# Altium project PowerManagementBoard_V3.PrjPcb
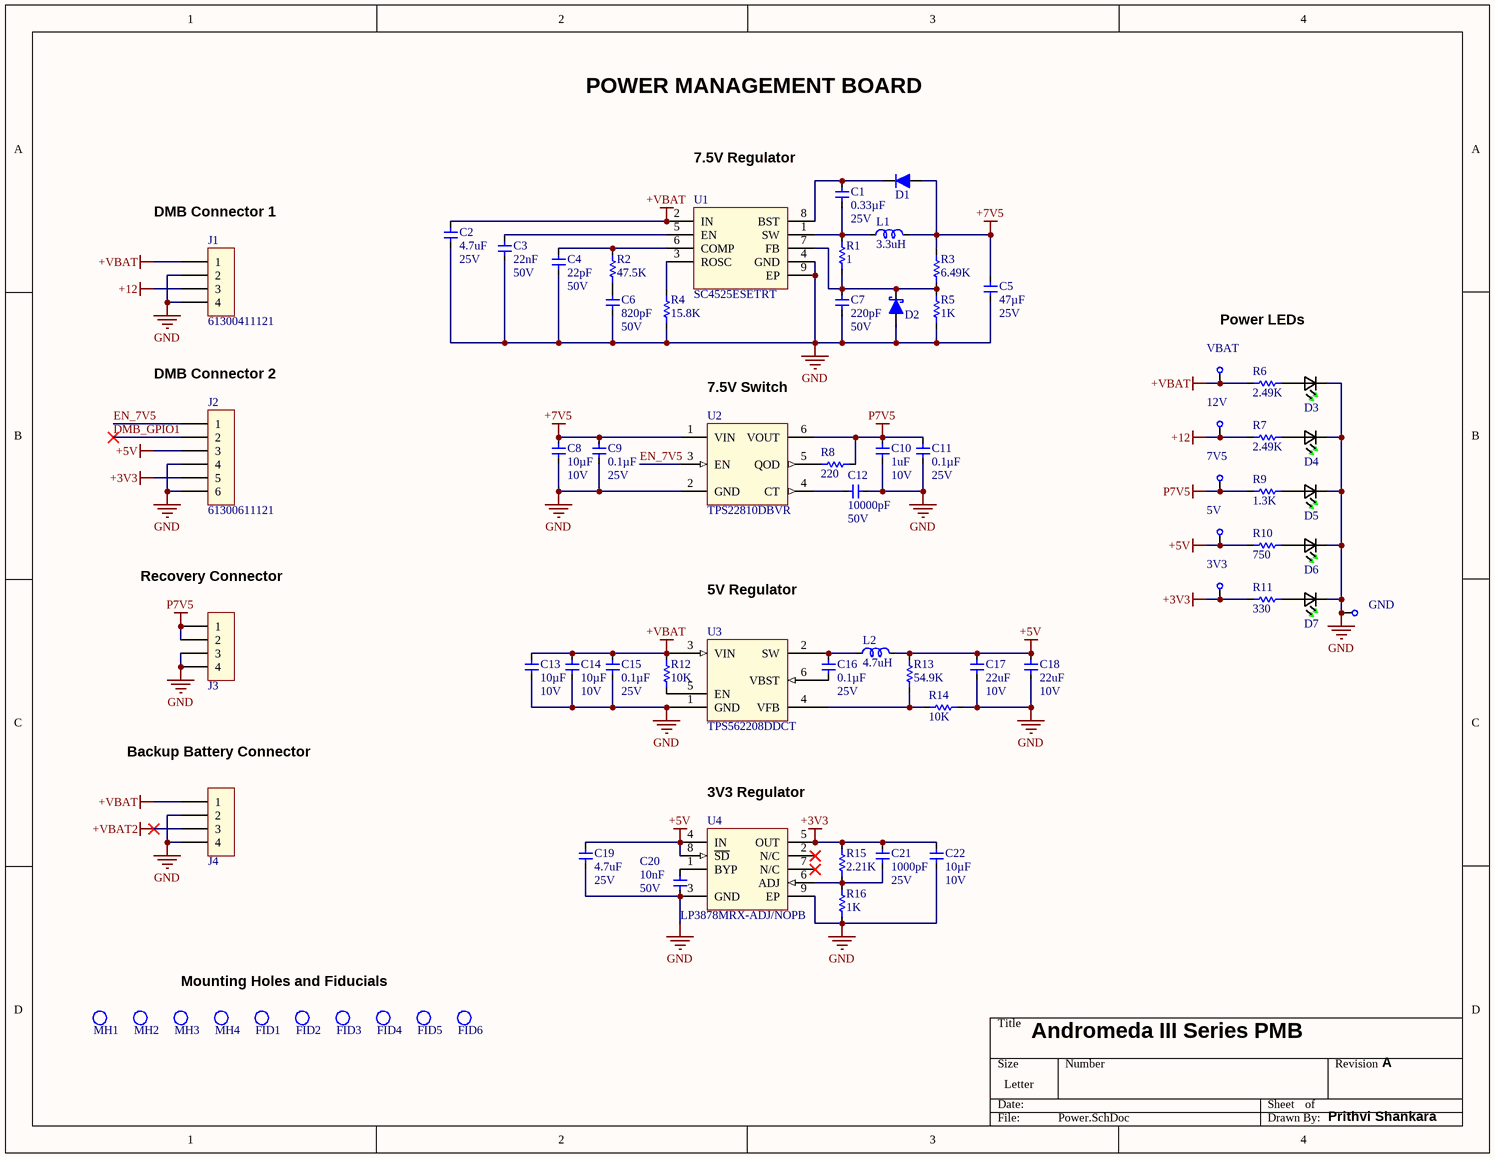
[diagram p0: Power.SchDoc]
1 sheet, 71 parts. Net scope: global (net labels, ports and power ports of the same name join across sheets).
Board file: PMBV3.PcbDoc

## Sheet Power.SchDoc
size Letter; DrawnBy: Prithvi Shankara; DocumentNumber: 1; SheetNumber: 1; SheetTotal: 1

### Parts
3V3  Testpoint  [Testpoint]  (value not drawn)  (no BOM)
5V  Testpoint  [Testpoint]  (value not drawn)  (no BOM)
7V5  Testpoint  [Testpoint]  (value not drawn)  (no BOM)
12V  Testpoint  [Testpoint]  (value not drawn)  (no BOM)
C1  Capacitance: 0.33µF  Voltage - Rated: 25V  [0603[1608]]  (hidden comment: CGA3E3X7R1E334K080AB)
C2  Capacitance: 4.7uF  Voltage - Rated: 25V  [0603[1608]]  (hidden comment: CL10A475KA8NQNC)
C3  Capacitance: 22nF  Voltage - Rated: 50V  [0603[1608]]  (hidden comment: CC0603KRX7R9BB223)
C4  Capacitance: 22pF  Voltage - Rated: 50V  [0603[1608]]  (hidden comment: CC0603JRNPO9BN220)
C5  Capacitance: 47µF  Voltage - Rated: 25V  [1206[3216]]  (hidden comment: C3216X5R1E476M160AC)
C6  Capacitance: 820pF  Voltage - Rated: 50V  [0603[1608]]  (hidden comment: CC0603KRX7R9BB821)
C7  Capacitance: 220pF  Voltage - Rated: 50V  [0603[1608]]  (hidden comment: CC0603KRX7R9BB221)
C8  Capacitance: 10µF  Voltage - Rated: 10V  [0603[1608]]  (hidden comment: CL10A106MP8NNNC)
C9  Capacitance: 0.1µF  Voltage - Rated: 25V  [0603[1608]]  (hidden comment: CGA3E2X7R1E104K080AA)
C10  Capacitance: 1uF  Voltage - Rated: 10V  [0603[1608]]  (hidden comment: CL10A105KP8NNNC)
C11  Capacitance: 0.1µF  Voltage - Rated: 25V  [0603[1608]]  (hidden comment: CGA3E2X7R1E104K080AA)
C12  Capacitance: 10000pF  Voltage - Rated: 50V  [0603[1608]]  (hidden comment: CGA3E2X7R1H103K080AA)
C13  Capacitance: 10µF  Voltage - Rated: 10V  [0603[1608]]  (hidden comment: CL10A106MP8NNNC)
C14  Capacitance: 10µF  Voltage - Rated: 10V  [0603[1608]]  (hidden comment: CL10A106MP8NNNC)
C15  Capacitance: 0.1µF  Voltage - Rated: 25V  [0603[1608]]  (hidden comment: CGA3E2X7R1E104K080AA)
C16  Capacitance: 0.1µF  Voltage - Rated: 25V  [0603[1608]]  (hidden comment: CGA3E2X7R1E104K080AA)
C17  Capacitance: 22uF  Voltage - Rated: 10V  [0603[1608]]  (hidden comment: C1608X5R1A226M080AC)
C18  Capacitance: 22uF  Voltage - Rated: 10V  [0603[1608]]  (hidden comment: C1608X5R1A226M080AC)
C19  Capacitance: 4.7uF  Voltage - Rated: 25V  [0603[1608]]  (hidden comment: CL10A475KA8NQNC)
C20  Capacitance: 10nF  Voltage - Rated: 50V  [0603[1608]]  (hidden comment: GRM1885C1H103JA01D)
C21  Capacitance: 1000pF  Voltage - Rated: 25V  [0603[1608]]  (hidden comment: C0603C102K3GACTU)
C22  Capacitance: 10µF  Voltage - Rated: 10V  [0603[1608]]  (hidden comment: CL10A106MP8NNNC)
D1  1N4148W-7-F  [1N4148W-7-F]  (value not drawn)
D2  B330A-13-F  [B330A-13-F]  (value not drawn)
D3  LTST-C191KGKT  [LTST-C191KGKT]  (value not drawn)
D4  LTST-C191KGKT  [LTST-C191KGKT]  (value not drawn)
D5  LTST-C191KGKT  [LTST-C191KGKT]  (value not drawn)
D6  LTST-C191KGKT  [LTST-C191KGKT]  (value not drawn)
D7  LTST-C191KGKT  [LTST-C191KGKT]  (value not drawn)
FID1  FID_1MM_ROUND_SL  [FID_1MM_ROUND_SL]  (value not drawn)  (no BOM)
FID2  FID_1MM_ROUND_SL  [FID_1MM_ROUND_SL]  (value not drawn)  (no BOM)
FID3  FID_1MM_ROUND_SL  [FID_1MM_ROUND_SL]  (value not drawn)  (no BOM)
FID4  FID_1MM_ROUND_SL  [FID_1MM_ROUND_SL]  (value not drawn)  (no BOM)
FID5  FID_1MM_ROUND_SL  [FID_1MM_ROUND_SL]  (value not drawn)  (no BOM)
FID6  FID_1MM_ROUND_SL  [FID_1MM_ROUND_SL]  (value not drawn)  (no BOM)
GND  Testpoint  [Testpoint]  (value not drawn)  (no BOM)
J1  61300411121  [61300411121]
J2  61300611121  [61300611121]
J3  0430450400  [0430450400]  (value not drawn)
J4  0430450400  [0430450400]  (value not drawn)
L1  value 3.3uH  [744777003]  (hidden comment: 744777003)
L2  value 4.7uH  [DFE252012P-4R7M=P2]  (hidden comment: DFE252012P-4R7M=P2)
MH1  9774110360R  [Standoff]  (value not drawn)
MH2  9774110360R  [Standoff]  (value not drawn)
MH3  Mounting Hole  [MOUNT-HOLE]  (value not drawn)  (no BOM)
MH4  Mounting Hole  [MOUNT-HOLE]  (value not drawn)  (no BOM)
R1  Resistance: 1  [0603[1608]]  (hidden comment: RC0603FR-071RL)
R2  Resistance: 47.5K  [0603[1608]]  (hidden comment: ERA-3AEB4752V)
R3  Resistance: 6.49K  [0603[1608]]  (hidden comment: RT0603DRE076K49L)
R4  Resistance: 15.8K  [0603[1608]]  (hidden comment: ERA-3AEB1582V)
R5  Resistance: 1K  [0603[1608]]  (hidden comment: RC0603FR-071KL)
R6  Resistance: 2.49K  [0603[1608]]  (hidden comment: ERA-3AEB2491V)
R7  Resistance: 2.49K  [0603[1608]]  (hidden comment: ERA-3AEB2491V)
R8  Resistance: 220  [0603[1608]]  (hidden comment: CRGCQ0603F220R)
R9  Resistance: 1.3K  [0603[1608]]  (hidden comment: MCT06030C1301FP500)
R10  Resistance: 750  [0603[1608]]  (hidden comment: ESR03EZPJ751)
R11  Resistance: 330  [0603[1608]]  (hidden comment: RC1608F331CS)
R12  Resistance: 10K  [0603[1608]]  (hidden comment: ERJ-3GEYJ103V)
R13  Resistance: 54.9K  [0603[1608]]  (hidden comment: RC0603FR-0754K9L)
R14  Resistance: 10K  [0603[1608]]  (hidden comment: ERJ-3GEYJ103V)
R15  Resistance: 2.21K  [0603[1608]]  (hidden comment: ERJ-3EKF2211V)
R16  Resistance: 1K  [0603[1608]]  (hidden comment: RC0603FR-071KL)
U1  SC4525ESETRT  [SOIC127P600X175_HS-9N]
U2  TPS22810DBVR  [SOT95P280X145-6N]
U3  TPS562208DDCT  [TPS562208DDCT]
U4  LP3878MRX-ADJ/NOPB  [SOIC127P600X170_HS-9N]
VBAT  Testpoint  [Testpoint]  (value not drawn)  (no BOM)

### Nets
+3V3: 3V3.1 C21.2 C22.2 J2.5 R11.1 R15.2 U4.5(OUT)
+5V: 5V.1 C17.2 C18.2 C19.2 J2.3 L2.2 R10.1 R13.1 U4.4(IN) U4.8(~{SD})
+7V5: C5.2 C8.2 C9.2 D1.1(A) L1.2 R3.2 U2.1(VIN)
+12: 12V.1 J1.3 R7.1
+VBAT: C2.2 C13.2 C14.2 C15.2 J1.1 J4.1 R6.1 R12.2 U1.2(IN) U3.3(VIN) VBAT.1
+VBAT2: J4.3
GND: C2.1 C3.1 C4.1 C5.1 C6.1 C7.1 C8.1 C9.1 C10.1 C11.1 C12.2 C13.1 C14.1 C15.1 C17.1 C18.1 C19.1 C20.1 C22.1 D2.1 D3.1(K2) D4.1(K2) D5.1(K2) D6.1(K2) D7.1(K2) GND.1 J1.2 J1.4 J2.4 J2.6 J3.3 J3.4 J4.2 J4.4 R4.1 R5.1 R14.1 R16.1 U1.4(GND) U1.9(EP) U2.2(GND) U3.1(GND) U4.3(GND) U4.9(EP)
P7V5: 7V5.1 C10.2 C11.2 J3.1 J3.2 R8.2 R9.1 U2.6(VOUT)
DMB_GPIO1: J2.2
EN_7V5: J2.1 U2.3(EN)
NetC1_1: C1.1 L1.1 R1.2 U1.1(SW)
NetC1_2: C1.2 D1.2(C) U1.8(BST)
NetC3_2: C3.2 U1.5(EN)
NetC4_2: C4.2 R2.2 U1.6(COMP)
NetC6_2: C6.2 R2.1
NetC7_2: C7.2 D2.2 R1.1 R3.1 R5.2 U1.7(FB)
NetC12_1: C12.1 U2.4(CT)
NetC16_1: C16.1 U3.6(VBST)
NetC16_2: C16.2 L2.1 U3.2(SW)
NetC20_2: C20.2 U4.1(BYP)
NetC21_1: C21.1 R15.1 R16.2 U4.6(ADJ)
NetD3_2: D3.2(A2) R6.2
NetD4_2: D4.2(A2) R7.2
NetD5_2: D5.2(A2) R9.2
NetD6_2: D6.2(A2) R10.2
NetD7_2: D7.2(A2) R11.2
NetR4_2: R4.2 U1.3(ROSC)
NetR8_1: R8.1 U2.5(QOD)
NetR12_1: R12.1 U3.5(EN)
NetR13_2: R13.2 R14.2 U3.4(VFB)

Not connected (* = marked no-connect by the designer): U4 2(N/C)* 7(N/C)*

### Notes on the sheet
- POWER MANAGEMENT BOARD
- 7.5V Regulator
- (near J1) DMB Connector 1
- Power LEDs
- DMB Connector 2
- (near U2) 7.5V Switch
- (near J3) Recovery Connector
- 5V Regulator
- (near J4) Backup Battery Connector
- 3V3 Regulator
- Mounting Holes and Fiducials
- Andromeda III Series PMB
- A
- Prithvi Shankara

### Library data of the parts
3V3 5V 7V5 12V GND VBAT = Testpoint: TESTPOINT 0.7MMD Hole, 1.2MMW, 1.2MML
C1 = CGA3E3X7R1E334K080AB: CAP CER 0.33UF 25V X7R 0603; Manufacturer: TDK Corporation; Tolerance: ±10%; Temperature Coefficient: X7R; Operating Temperature: -55°C ~ 125°C; Mounting Type: Surface Mount, MLCC; Package / Case: 0603 (1608 Metric); Size / Dimension: 0.063" L x 0.031" W (1.60mm x 0.80mm); Manufacturer Part Number: CGA3E3X7R1E334K080AB; Thickness (Max): 0.034" (0.87mm); ComponentLink1Description: Datasheet; ComponentLink1URL: https://content.kemet.com/datasheets/KEM_C1003_C0G_SMD.pdf; Supplier 1: Digi-Key; Supplier Part Number 1: 445-12544-1-ND
C2 C19 = CL10A475KA8NQNC: CAP CER 4.7UF 25V X5R 0603; Manufacturer: Samsung Electro-Mechanics; Tolerance: ±10%; Temperature Coefficient: X5R; Operating Temperature: -55°C ~ 85°C; Mounting Type: Surface Mount, MLCC; Package / Case: 0603 (1608 Metric); Size / Dimension: 0.063" L x 0.031" W (1.60mm x 0.80mm); Manufacturer Part Number: CL10A475KA8NQNC; Thickness (Max): 0.035" (0.90mm); ComponentLink1Description: Datasheet; ComponentLink1URL: http://www.samsungsem.com/kr/support/product-search/mlcc/__icsFiles/afieldfile/2019/05/10/19-CL10A475KA8NQNC.pdf; Supplier 1: Digi-Key; Supplier Part Number 1: 1276-1900-1-ND
C3 = CC0603KRX7R9BB223: CAP CER 0.022UF 50V X7R 0603; Manufacturer: Yageo; Tolerance: ±10%; Temperature Coefficient: X7R; Operating Temperature: -55°C ~ 125°C; Mounting Type: Surface Mount, MLCC; Package / Case: 0603 (1608 Metric); Size / Dimension: 0.063" L x 0.031" W (1.60mm x 0.80mm); Manufacturer Part Number: CC0603KRX7R9BB223; Thickness (Max): 0.035" (0.90mm); ComponentLink1Description: Datasheet; ComponentLink1URL: https://www.yageo.com/upload/media/product/productsearch/datasheet/mlcc/UPY-GP_NP0_16V-to-50V_18.pdf; Supplier 1: Digi-Key; Supplier Part Number 1: 311-1370-1-ND
C4 = CC0603JRNPO9BN220: CAP CER 22PF 50V C0G/NPO 0603; Manufacturer: Yageo; Tolerance: ±5%; Temperature Coefficient: C0G, NP0; Operating Temperature: -55°C ~ 125°C; Mounting Type: Surface Mount, MLCC; Package / Case: 0603 (1608 Metric); Size / Dimension: 0.063" L x 0.031" W (1.60mm x 0.80mm); Manufacturer Part Number: CC0603JRNPO9BN220; Thickness (Max): 0.035" (0.90mm); ComponentLink1Description: Datasheet; ComponentLink1URL: https://www.yageo.com/upload/media/product/productsearch/datasheet/mlcc/UPY-GP_NP0_16V-to-50V_18.pdf; Supplier 1: Digi-Key; Supplier Part Number 1: 311-1062-1-ND
C5 = C3216X5R1E476M160AC: CAP CER 47UF 25V X5R 1206; Manufacturer: TDK Corporation; Tolerance: ±20%; Temperature Coefficient: X5R; Operating Temperature: -55°C ~ 85°C; Mounting Type: Surface Mount, MLCC; Package / Case: 1206 (3216 Metric); Size / Dimension: 0.126" L x 0.063" W (3.20mm x 1.60mm); Manufacturer Part Number: C3216X5R1E476M160AC; Thickness (Max): 0.071" (1.80mm); ComponentLink1Description: Datasheet; ComponentLink1URL: http://www.samsungsem.com/kr/support/product-search/mlcc/__icsFiles/afieldfile/2019/05/10/19-CL10A105KP8NNNC.pdf; Supplier 1: Digi-Key; Supplier Part Number 1: 445-8047-1-ND
C6 = CC0603KRX7R9BB821: CAP CER 820PF 50V X7R 0603; Manufacturer: Yageo; Tolerance: ±10%; Temperature Coefficient: X7R; Operating Temperature: -55°C ~ 125°C; Mounting Type: Surface Mount, MLCC; Package / Case: 0603 (1608 Metric); Size / Dimension: 0.063" L x 0.031" W (1.60mm x 0.80mm); Manufacturer Part Number: CC0603KRX7R9BB821; Thickness (Max): 0.035" (0.90mm); ComponentLink1Description: Datasheet; ComponentLink1URL: https://www.yageo.com/upload/media/product/productsearch/datasheet/mlcc/UPY-GP_NP0_16V-to-50V_18.pdf; Supplier 1: Digi-Key; Supplier Part Number 1: 311-1189-1-ND
C7 = CC0603KRX7R9BB221: CAP CER 220PF 50V X7R 0603; Manufacturer: Yageo; Tolerance: ±10%; Temperature Coefficient: X7R; Operating Temperature: -55°C ~ 125°C; Mounting Type: Surface Mount, MLCC; Package / Case: 0603 (1608 Metric); Size / Dimension: 0.063" L x 0.031" W (1.60mm x 0.80mm); Manufacturer Part Number: CC0603KRX7R9BB221; Thickness (Max): 0.035" (0.90mm); ComponentLink1Description: Datasheet; ComponentLink1URL: https://www.yageo.com/upload/media/product/productsearch/datasheet/mlcc/UPY-GP_NP0_16V-to-50V_18.pdf; Supplier 1: Digi-Key; Supplier Part Number 1: 311-1077-1-ND
C8 C13 C14 C22 = CL10A106MP8NNNC: CAP CER 10UF 10V X5R 0603; Manufacturer: Samsung Electro-Mechanics; Tolerance: ±20%; Temperature Coefficient: X5R; Operating Temperature: -55°C ~ 85°C; Mounting Type: Surface Mount, MLCC; Package / Case: 0603 (1608 Metric); Size / Dimension: 0.063" L x 0.031" W (1.60mm x 0.80mm); Manufacturer Part Number: CL10A106MP8NNNC; Thickness (Max): 0.035" (0.90mm); ComponentLink1Description: Datasheet; ComponentLink1URL: https://static6.arrow.com/aropdfconversion/f91a1722e2705c3d73cfb1979021b64ae4055093/19-cl10a106mp8nnnc.pdf; Supplier 1: Digi-Key; Supplier Part Number 1: 1276-1871-1-ND
C9 C11 C15 C16 = CGA3E2X7R1E104K080AA: CAP CER 0.1UF 25V X7R 0603; Manufacturer: TDK Corporation; Tolerance: ±10%; Temperature Coefficient: X7R; Operating Temperature: -55°C ~ 125°C; Mounting Type: Surface Mount, MLCC; Package / Case: 0603 (1608 Metric); Size / Dimension: 0.063" L x 0.031" W (1.60mm x 0.80mm); Manufacturer Part Number: CGA3E2X7R1E104K080AA; Thickness (Max): 0.035" (0.90mm); ComponentLink1Description: Datasheet; ComponentLink1URL: https://product.tdk.com/info/en/catalog/spec/mlccspec_automotive_general_en.pdf; Supplier 1: Digi-Key; Supplier Part Number 1: 445-5667-1-ND
C10 = CL10A105KP8NNNC: CAP CER 1UF 10V X5R 0603; Manufacturer: Samsung Electro-Mechanics; Tolerance: ±10%; Temperature Coefficient: X5R; Operating Temperature: -55°C ~ 85°C; Mounting Type: Surface Mount, MLCC; Package / Case: 0603 (1608 Metric); Size / Dimension: 0.063" L x 0.031" W (1.60mm x 0.80mm); Manufacturer Part Number: CL10A105KP8NNNC; Thickness (Max): 0.035" (0.90mm); ComponentLink1Description: Datasheet; ComponentLink1URL: http://www.samsungsem.com/kr/support/product-search/mlcc/__icsFiles/afieldfile/2019/05/10/19-CL10A105KP8NNNC.pdf; Supplier 1: Digi-Key; Supplier Part Number 1: 1276-1182-1-ND
C12 = CGA3E2X7R1H103K080AA: CAP CER 10000PF 50V X7R 0603; Manufacturer: TDK Corporation; Tolerance: ±10%; Temperature Coefficient: X7R; Operating Temperature: -55°C ~ 125°C; Mounting Type: Surface Mount, MLCC; Package / Case: 0603 (1608 Metric); Size / Dimension: 0.063" L x 0.031" W (1.60mm x 0.80mm); Manufacturer Part Number: CGA3E2X7R1H103K080AA; Thickness (Max): 0.035" (0.90mm); ComponentLink1Description: Datasheet; ComponentLink1URL: https://product.tdk.com/info/en/catalog/spec/mlccspec_automotive_general_en.pdf; Supplier 1: Digi-Key; Supplier Part Number 1: 445-5662-1-ND
C17 C18 = C1608X5R1A226M080AC: CAP CER 22UF 10V X5R 0603; Manufacturer: TDK Corporation; Tolerance: ±20%; Temperature Coefficient: X5R; Operating Temperature: -55°C ~ 85°C; Mounting Type: Surface Mount, MLCC; Package / Case: 0603 (1608 Metric); Size / Dimension: 0.063" L x 0.031" W (1.60mm x 0.80mm); Manufacturer Part Number: C1608X5R1A226M080AC; Thickness (Max): 0.039" (1.00mm); ComponentLink1Description: Datasheet; ComponentLink1URL: http://datasheets.avx.com/C0GNP0-Dielectric.pdf; Supplier 1: Digi-Key; Supplier Part Number 1: 445-9077-1-ND
C20 = GRM1885C1H103JA01D: CAP CER 10000PF 50V C0G/NP0 0603; Manufacturer: Murata Electronics; Tolerance: ±50%; Temperature Coefficient: C0G, NP0; Operating Temperature: -55°C ~ 125°C; Mounting Type: Surface Mount, MLCC; Package / Case: 0603 (1608 Metric); Size / Dimension: 0.063" L x 0.031" W (1.60mm x 0.80mm); Manufacturer Part Number: GRM1885C1H103JA01D; Thickness (Max): 0.035" (0.90mm); ComponentLink1Description: Datasheet; ComponentLink1URL: https://www.murata.com/~/media/webrenewal/support/library/catalog/products/capacitor/mlcc/c02e.ashx?la=en-us; Supplier 1: Digi-Key; Supplier Part Number 1: 490-9666-1-ND
C21 = C0603C102K3GACTU: CAP CER 1000PF 25V C0G/NP0 0603; Manufacturer: KEMET; Tolerance: ±10%; Temperature Coefficient: C0G, NP0; Operating Temperature: -55°C ~ 85°C; Mounting Type: Surface Mount, MLCC; Package / Case: 0603 (1608 Metric); Size / Dimension: 0.063" L x 0.031" W (1.60mm x 0.80mm); Manufacturer Part Number: C0603C102K3GACTU; Thickness (Max): 0.034" (0.87mm); ComponentLink1Description: Datasheet; ComponentLink1URL: https://content.kemet.com/datasheets/KEM_C1003_C0G_SMD.pdf; Supplier 1: Digi-Key; Supplier Part Number 1: 399-7833-1-ND
D1 = 1N4148W-7-F: DIODE GEN PURP 100V 300MA SOD123; Manufacturer: Diodes Incorporated; Diode Type: Standard; Current - Average Rectified (Io): 300mA (DC); Voltage - Forward (Vf) (Max) @ If: 1.25V @ 150mA; Speed: Small Signal =< 200mA (Io), Any Speed; Reverse Recovery Time (trr): 4ns; Current - Reverse Leakage @ Vr: 1µA @ 75V; Capacitance @ Vr, F: 2pF @ 0V, 1MHz; ComponentLink1Description: Datasheet; ComponentLink1URL: https://www.diodes.com/assets/Datasheets/ds30086.pdf; Manufacturer Part Number: 1N4148W-7-F; Voltage - DC Reverse (Vr) (Max): 100V; Mounting Type: Surface Mount; Package / Case: SOD-123; Operating Temperature - Junction: -65°C ~ 150°C; Supplier 1: Digi-Key; Supplier Part Number 1: 1N4148W-FDICT-ND
D2 = B330A-13-F: DIODE SCHOTTKY 30V 3A SMA; Manufacturer: Diodes Incorporated; Voltage - Forward (Vf) (Max) @ If: 500mV @ 3A; 500mV @ 3A: Fast Recovery =< 500ns, > 200mA (Io); Current - Reverse Leakage @ Vr: 500µA @ 30V; Capacitance @ Vr, F: 200pF @ 4V, 1MHz; ComponentLink1Description: Datasheet; ComponentLink1URL: https://www.diodes.com/assets/Datasheets/ds30891.pdf; Manufacturer Part Number: B330A-13-F; Type: Schottky; Supplier 1: Digi-Key; Supplier Part Number 1: B330A-FDICT-ND; Voltage - DC Reverse (Vr) (Max): 30V; Current - Average Rectified (Io): 3A; Mounting Type: Surface Mount; Package / Case: DO-214AC, SMA; Operating Temperature - Junction: -55°C ~ 150°C
D3-D7 = LTST-C191KGKT: LED GREEN CLEAR SMD 0603; Manufacturer: Lite-On Inc.; Lens Color: Colourless; Millicandela Rating: 35mcd; Lens Style: Rectangle with Flat Top; Lens Size: 1.10mm x 0.80mm; Voltage - Forward (Vf) (Typ): 2V; Current - Test: 20mA; Viewing Angle: 130°; Wavelength - Dominant: 571nm; Wavelength - Peak: 574nm; ComponentLink1Description: Datasheet; ComponentLink1URL: http://optoelectronics.liteon.com/upload/download/DS22-2000-228/LTST-C191KGKT.PDF; Manufacturer Part Number: LTST-C191KGKT; Colour: Green; Lens Transparency: Clear; Mounting Type: Surface Mount; Package / Case: 0603 (1608 Metric); Size / Dimension: 1.60mm L x 0.80mm W; Height (Max): 0.65mm; Supplier 1: Digi-Key; Supplier Part Number 1: 160-1446-1-ND
FID1-FID6 = FID_1MM_ROUND_SL: Fiducial 1mm Round Single Layer
J1 = 61300411121: CONN HEADER VERT 4POS MALE 2.54MM; Manufacturer: Würth Elektronik; Pitch - Mating: 0.100" (2.54mm); Number of Positions: 4; Style: Board to Board or Cable; Shrouding: Unshrouded; Contact Length - Mating: 0.236" (6.00mm); Contact Length - Post: 0.118" (3.00mm); Overall Contact Length: 0.454" (11.54mm); Material Flammability Rating: UL94 V-0; Current Rating (Amps): 3A; Voltage Rating: 250V; ComponentLink1Description: Drawing; ComponentLink1URL: https://www.we-online.de/katalog/datasheet/6130xx11121.pdf; Manufacturer Part Number: 61300411121; Connector Type: Header; Contact Type: Male Pin; Number of Rows: 1; Mounting Type: Through Hole; Termination: Solder; Fastening Type: Push-Pull; Insulation Height: 0.100" (2.54mm); Contact Shape: Square; Contact Finish - Mating: Gold; Contact Material: Copper Alloy; Insulation Material: Polybutylene Terephthalate (PBT); Operating Temperature: -40°C ~ 105°C; Insulation Color: Black; Supplier 1: Digi-Key; Supplier Part Number 1: 732-5317-ND
J2 = 61300611121: CONN HEADER VERT 6POS MALE 2.54MM; Manufacturer: Würth Elektronik; Pitch - Mating: 0.100" (2.54mm); Number of Positions: 6; Style: Board to Board or Cable; Shrouding: Unshrouded; Contact Length - Mating: 0.236" (6.00mm); Contact Length - Post: 0.118" (3.00mm); Overall Contact Length: 0.454" (11.54mm); Material Flammability Rating: UL94 V-0; Current Rating (Amps): 3A; Voltage Rating: 250V; ComponentLink1Description: Drawing; ComponentLink1URL: https://www.we-online.de/katalog/datasheet/6130xx11121.pdf; Manufacturer Part Number: 61300611121; Connector Type: Header; Contact Type: Male Pin; Number of Rows: 1; Mounting Type: Through Hole; Termination: Solder; Fastening Type: Push-Pull; Insulation Height: 0.100" (2.54mm); Contact Shape: Square; Contact Finish - Mating: Gold; Contact Material: Copper Alloy; Insulation Material: Polybutylene Terephthalate (PBT); Operating Temperature: -40°C ~ 105°C; Insulation Color: Black; Supplier 1: Digi-Key; Supplier Part Number 1: 732-5319-ND
J3 J4 = 0430450400: CONN HEADER R/A 4POS 3MM; Manufacturer: Molex; Number of Positions: 4; Row Spacing - Mating: 0.118" (3.00mm); Shrouding: Shrouded - 4 Wall; Contact Length - Post: 0.125" (3.18mm); Material Flammability Rating: UL94 V-0; Current Rating (Amps): 8A; Voltage Rating: 600V; ComponentLink1Description: Datasheet; ComponentLink1URL: https://www.molex.com/pdm_docs/sd/430450400_sd.pdf; ComponentLink2Description: Product Specification; ComponentLink2URL: https://www.molex.com/pdm_docs/ps/PS-43045.pdf; Manufacturer Part Number: 0430450400; Contact Type: 0.118" (3.00mm); Number of Rows: 2; Mounting Type: Through Hole, Right Angle; Termination: Solder; Fastening Type: Locking Ramp; Insulation Height: 0.290" (7.37mm); Contact Shape: Square; Contact Finish - Mating: Tin; Contact Finish Thickness - Mating: 100.0µin (2.54µm); Contact Finish - Post: Tin; Contact Material: Brass; Insulation Material: Liquid Crystal Polymer (LCP), Glass Filled; Features: Board Lock; Insulation Color: Black; Supplier 1: Digi-Key; Supplier Part Number 1: WM1814-ND
L1 = 744777003: SMT SHIELDED POWER INDUCTOR SIZE; Manufacturer: Würth Elektronik; Type: Wirewound; Material - Core: Ferrite; Tolerance: +-20%; Current Rating (Amps): 3.5A; DC Resistance (DCR): 30mOhm Max; Inductance Frequency - Test: 55MHz; Current - Saturation: 4.6A; Series: 744777003; Shielding: Shielded; Operating Temperature: -40°C ~ 125°C; Mounting Type: Surface Mount; Size/Dimension: 0.287"" L x 0.287"" W (7.30mm x 7.30mm); Height - Seated (Max): 0.177"" (4.50mm); ComponentLink1Description: Datasheet; ComponentLink1URL: https://www.we-online.com/catalog/datasheet/744777003.pdf; Supplier Device Package: 7345; Supplier 1: Digi-Key; Supplier Part Number 1: 732-13497-1-ND; Ratings: AEC-Q200
L2 = DFE252012P-4R7M=P2: FIXED IND 4.7UH 2A 200 MOHM SMD; Manufacturer: Murata Electronics; Type: Wirewound; Material - Core: Iron Powder; Tolerance: +-20%; Shielding: Shielded; DC Resistance (DCR): 200mOhm Max; Inductance Frequency - Test: 1MHz; Supplier 1: Digi-Key; Series: DFE252012P; Current Rating (Amps): 2A; Operating Temperature: -40C to 125C; Mounting Type: Surface Mount; Size/Dimension: 0.098" L x 0.079" W (2.50mm x 2.00mm); Height - Seated (Max): 0.047" (1.20mm); Supplier Part Number 1: 490-10651-1-ND; Manufacturer Part Number: DFE252012P-4R7M=P2
MH1 MH2 = 9774110360R: ROUND STANDOFF M3X0.5 STEEL 11MM; Manufacturer: Würth Elektronik; Threaded/Unthreaded: Threaded; Gender: Female; Between Board Height: 0.433" (11.00mm); ComponentLink1Description: Datasheet; ComponentLink1URL: https://www.keyelco.com/userAssets/file/M65p77.pdf; Manufacturer Part Number: 9774110360R; Type: Round Standoff; Screw, Thread Size: M3x0.5; Diameter - Outside: 0.236" (5.99mm); Length - Overall: 0.488" (12.40mm); Material: Steel; Features: Surface Mount; Supplier 1: Digi-Key; Supplier Part Number 1: 732-5278-1-ND
MH3 MH4 = Mounting Hole: #4 Screw, 0.116in Diameter
R1 = RC0603FR-071RL: RES SMD 1 OHM 1% 1/10W 0603; Manufacturer: Yageo; Power  (W): 0.1W; Temperature Coefficient: ±200ppm/°C; Package: 0603 (1608 Metric); Tolerance: ±1%; Operating Temperature: -55°C ~ 155°C; Composition: Thick Film; Manufacturer Part Number: RC0603FR-071RL; ComponentLink1Description: Datasheet; ComponentLink1URL: https://www.yageo.com/upload/media/product/productsearch/datasheet/rchip/PYu-RC_Group_51_RoHS_L_10.pdf; Supplier 1: Digi-Key; Supplier Part Number 1: 311-1.00HRCT-ND
R2 = ERA-3AEB4752V: RES SMD 47.5KOHM 0.1% 1/10W 0603; Manufacturer: Panasonic Electronic Components; Power  (W): 0.1W; Temperature Coefficient: ±25ppm/°C; Package: 0603 (1608 Metric); Tolerance: ±0.1%; Operating Temperature: -55°C ~ 155°C; Composition: Thin Film; Manufacturer Part Number: ERA-3AEB4752V; ComponentLink1Description: Datasheet; ComponentLink1URL: https://industrial.panasonic.com/cdbs/www-data/pdf/RDM0000/AOA0000C307.pdf; Supplier 1: Digi-Key; Supplier Part Number 1: P47.5KDBCT-ND
R3 = RT0603DRE076K49L: RES SMD 6.49KOHM 0.5% 1/10W 0603; Manufacturer: Yageo; Power  (W): 0.1W; Temperature Coefficient: ±500ppm/°C; Package: 0603 (1608 Metric); Tolerance: ±0.5%; Operating Temperature: -55°C ~ 155°C; Composition: Thick Film; Manufacturer Part Number: RT0603DRE076K49L; ComponentLink1Description: Datasheet; ComponentLink1URL: https://4donline.ihs.com/images/VipMasterIC/IC/YAGO/YAGO-S-A0008510989/YAGO-S-A0008510989-1.pdf?hkey=52A5661711E402568146F3353EA87419; Supplier 1: Digi-Key; Supplier Part Number 1: 311-2658-1-ND
R4 = ERA-3AEB1582V: RES SMD 15.8KOHM 0.1% 1/10W 0603; Manufacturer: Panasonic Electronic Components; Power  (W): 0.1W; Temperature Coefficient: ±25ppm/°C; Package: 0603 (1608 Metric); Tolerance: ±0.1%; Operating Temperature: -55°C ~ 155°C; Composition: Thin Film; Manufacturer Part Number: ERA-3AEB1582V; ComponentLink1Description: Datasheet; ComponentLink1URL: https://industrial.panasonic.com/cdbs/www-data/pdf/RDM0000/AOA0000C307.pdf; Supplier 1: Digi-Key; Supplier Part Number 1: P15.8KDBCT-ND
R5 R16 = RC0603FR-071KL: RES SMD 1K OHM 1% 1/10W 0603; Manufacturer: Yageo; Power  (W): 0.1W; Temperature Coefficient: ±100ppm/°C; Package: 0603 (1608 Metric); Tolerance: ±1%; Operating Temperature: -55°C ~ 155°C; Composition: Thick Film; Manufacturer Part Number: RC0603FR-071KL; ComponentLink1Description: Datasheet; ComponentLink1URL: https://www.yageo.com/upload/media/product/productsearch/datasheet/rchip/PYu-RC_Group_51_RoHS_L_10.pdf; Supplier 1: Digi-Key; Supplier Part Number 1: 311-30.0KHRCT-ND
R6 R7 = ERA-3AEB2491V: RES SMD 2.49KOHM 0.1% 1/10W 0603; Manufacturer: Panasonic Electronic Components; Power  (W): 0.1W; Temperature Coefficient: ±25ppm/°C; Package: 0603 (1608 Metric); Tolerance: ±0.1%; Operating Temperature: -55°C ~ 155°C; Composition: Thin Film; Manufacturer Part Number: ERA-3AEB2491V; ComponentLink1Description: Datasheet; ComponentLink1URL: https://industrial.panasonic.com/cdbs/www-data/pdf/RDM0000/AOA0000C307.pdf; Supplier 1: Digi-Key; Supplier Part Number 1: P2.49KDBCT-ND
R8 = CRGCQ0603F220R: CRGCQ 0603 220R 1%; Manufacturer: TE Connectivity Passive Product; Power  (W): 0.1W; Temperature Coefficient: ±100ppm/°C; Package: 0603 (1608 Metric); Tolerance: ±1%; Operating Temperature: -55°C ~ 155°C; Composition: Thick Film; Manufacturer Part Number: CRGCQ0603F220R; ComponentLink1Description: Datasheet; ComponentLink1URL: https://www.yageo.com/upload/media/product/productsearch/datasheet/rchip/PYu-RC_Group_51_RoHS_L_10.pdf; Supplier 1: Digi-Key; Supplier Part Number 1: A129680CT-ND
R9 = MCT06030C1301FP500: RES SMD 1.3K OHM 1% 1/8W 0603; Manufacturer: Vishay Beyschlag; Temperature Coefficient: ±50ppm/°C; Power  (W): 1/8W; Package: 0603 (1608 Metric); Tolerance: ±1%; Operating Temperature: -55°C ~ 155°C; Composition: Thin Film; Manufacturer Part Number: MCT06030C1301FP500; ComponentLink1Description: Datasheet; ComponentLink1URL: http://www.vishay.com/docs/28705/mcx0x0xpro.pdf; Supplier 1: Digi-Key; Supplier Part Number 1: 749-1605-1-ND
R10 = ESR03EZPJ751: RES SMD 750 OHM 5% 1/4W 0603; Manufacturer: Rohm Semiconductor; Power  (W): 0.25W; Temperature Coefficient: ±200ppm/°C; Package: 0603 (1608 Metric); Tolerance: ±5%; Operating Temperature: -55°C ~ 155°C; Composition: Thick Film; Manufacturer Part Number: ESR03EZPJ751; ComponentLink1Description: Datasheet; ComponentLink1URL: https://d1d2qsbl8m0m72.cloudfront.net/en/products/databook/datasheet/passive/resistor/chip_resistor/esr-e.pdf; Supplier 1: Digi-Key; Supplier Part Number 1: RHM750DCT-ND
R11 = RC1608F331CS: RES SMD 330 OHM 1% 1/10W 0603; Manufacturer: Samsung Electro-Mechanics; Power  (W): 0.1W; Temperature Coefficient: ±100ppm/°C; Package: 0603 (1608 Metric); Tolerance: ±1%; Operating Temperature: -55°C ~ 155°C; Composition: Thick Film; Manufacturer Part Number: RC1608F331CS; ComponentLink1Description: Datasheet; ComponentLink1URL: http://www.samsungsem.com/kr/support/product-search/chip-resistor/__icsFiles/afieldfile/2019/01/21/RC_Spec_Sheet(1901).pdf; Supplier 1: Digi-Key; Supplier Part Number 1: 1276-4604-2-ND
R12 R14 = ERJ-3GEYJ103V: RES SMD 10K OHM 5% 1/10W 0603; Manufacturer: Panasonic Electronic Components; Power  (W): 0.1W; Temperature Coefficient: ±200ppm/°C; Package: 0603 (1608 Metric); Tolerance: ±5%; Operating Temperature: -55°C ~ 155°C; Composition: Thick Film; Manufacturer Part Number: ERJ-3GEYJ103V; ComponentLink1Description: Datasheet; ComponentLink1URL: http://www.yageo.com/documents/recent/PYu-RC_Group_51_RoHS_L_9.pdf; Supplier 1: Digi-Key; Supplier Part Number 1: P10KGCT-ND
R13 = RC0603FR-0754K9L: RES SMD 54.9K OHM 1% 1/10W 0603; Manufacturer: Yageo; Power  (W): 0.1W; Temperature Coefficient: ±100ppm/°C; Package: 0603 (1608 Metric); Tolerance: ±1%; Operating Temperature: -55°C ~ 155°C; Composition: Thick Film; Manufacturer Part Number: RC0603FR-0754K9L; ComponentLink1Description: Datasheet; ComponentLink1URL: https://www.yageo.com/upload/media/product/productsearch/datasheet/rchip/PYu-RC_Group_51_RoHS_L_10.pdf; Supplier 1: Digi-Key; Supplier Part Number 1: 311-54.9KHRDKR-ND
R15 = ERJ-3EKF2211V: RES SMD 2.21K OHM 1% 1/10W 0603; Manufacturer: Panasonic Electronic Components; Manufacturer Part Number: ERJ-3GEYJ103V; Power  (W): 0.1W; Temperature Coefficient: ±100ppm/°C; Package: 0603 (1608 Metric); Tolerance: ±1%; Operating Temperature: -55°C ~ 155°C; Composition: Thick Film; ComponentLink1Description: Datasheet; ComponentLink1URL: https://industrial.panasonic.com/cdbs/www-data/pdf/RDA0000/AOA0000C304.pdf; Supplier 1: Digi-Key; Supplier Part Number 1: P10KGCT-ND
U1 = SC4525ESETRT: IC REG BUCK ADJUSTABLE 3A 8SOIC; Manufacturer: Semtech Corporation; ComponentLink1Description: Datasheet; ComponentLink1URL: https://semtech.my.salesforce.com/sfc/p/#E0000000JelG/a/2R0000001Nr2/6kOzpjdk.AJmLpgrGiFAWW58LpG5sa.kG4035Q65fV4; Manufacturer Part Number: SC4525ESETRT
U2 = TPS22810DBVR: IC PWR SWITCH N-CHAN 1:1 SOT23-6; Manufacturer: Texas Instruments; Manufacturer Part Number: TPS22810DBVR; ComponentLink1Description: Datasheet; ComponentLink1URL: http://www.ti.com/lit/ds/symlink/tps22810.pdf
U3 = TPS562208DDCT: IC REG BUCK ADJ 2A TSOT23-6; Manufacturer: Texas Instruments; Function: Step-Down; Output Configuration: Positive; Output Type: Adjustable; Number of Outputs: 1; Voltage - Input (Min): 4.5V; Voltage - Input (Max): 17V; Voltage - Output (Min/Fixed): 0.768V; Frequency - Switching: 580kHz; Synchronous Rectifier: Yes; Supplier 1: Digi-Key; Supplier Part Number 1: 296-43806-1-ND; Series: D-CAP2™, Eco-Mode™; Packaging: Cut Tape (CT); Topology: Buck; Voltage - Output (Max): 17V; Current - Output: 2A; Operating Temperature: -40°C ~ 125°C (TJ); Mounting Type: Surface Mount; ComponentLink1Description: Datasheet; ComponentLink1URL: http://www.ti.com/general/docs/suppproductinfo.tsp?distId=10&gotoUrl=http%3A%2F%2Fwww.ti.com%2Flit%2Fgpn%2Ftps562208
U4 = LP3878MRX-ADJ/NOPB: IC REG LIN POS ADJ 800MA 8SO; Manufacturer: Texas Instruments; Number of Regulators: 1; Voltage - Input (Max): 16V; Voltage - Output (Min/Fixed): 1V; Voltage - Output (Max): 5.5V; Voltage Dropout (Max): 1.1V @ 800mA; Current - Quiescent (Iq): 1.5mA; Current - Supply (Max): 15mA; PSRR: 60dB (1kHz); Control Features: Enable; Protection Features: Over Current, Over Temperature, Short Circuit; ComponentLink1Description: Datasheet; ComponentLink1URL: http://www.ti.com/lit/ds/symlink/lp3878-adj.pdf; Manufacturer Part Number: LP3878MRX-ADJ/NOPB; Current - Output: 800mA; Operating Temperature: -40°C ~ 125°C; Mounting Type: Surface Mount; Package / Case: 8-PowerSOIC (0.154", 3.90mm Width); Base Part Number: LP3878; Supplier 1: Digi-Key; Supplier Part Number 1: LP3878MRX-ADJ/NOPBTR-ND